# EasyEDA Pro project 密码存储器.eprj, board PCB1
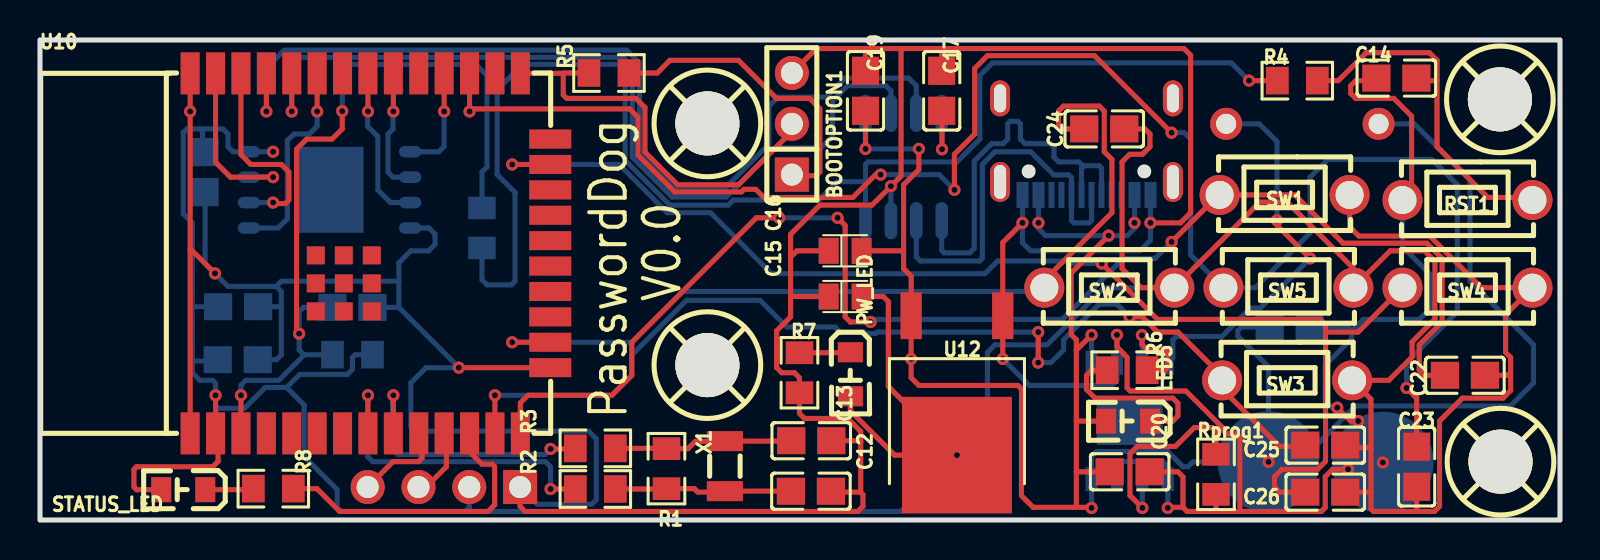
[diagram p2: board, top side]
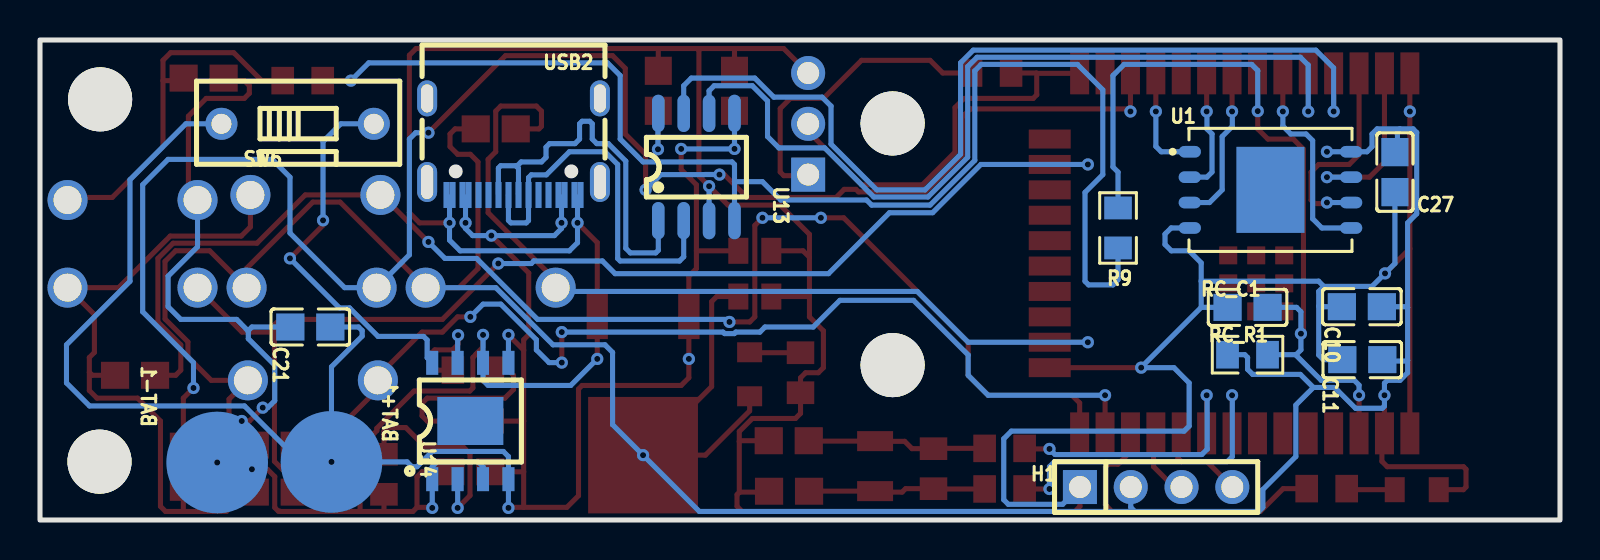
[diagram p3: board, bottom side, seen from below]

Outline 76 x 24 mm; copper layers: Top Layer, Bottom Layer. Coordinates in mm from the lower left corner of the outline.
Outline path: rectangle 0,24 76,0
Stack: Top Layer 0.035mm / Dielectric1 1.51mm FR4 er 4.5 / Bottom Layer 0.035mm

## Design rules (mm)
net UD+: DP1
net UD-: DP1
template: JLCPCB Capability(Two Layers Board)
spacing copperThickness1oz (default): track to track 0.102, other pairs 0.152 to 0.3
spacing copperThickness2oz: track to track 0.203, other pairs 0.152 to 0.3
track width copperThickness1oz (default): min 0.127, default 0.254, max 2.54
track width copperThickness2oz: min 0.203, default 0.254, max 2.54
differential pair differentialPair (default): width min 0.127, default 0.254, max 2.54; gap min 0.152, default 0.152
via viaSize (default): diameter min 0.5, default 0.61, max 10; hole min 0.3, default 0.305, max 6.3

## Placement (name value [footprint] x y rotation side)
BAT+1  -  [Test-Point-0.5mm]  61.43 2.91 0 top
BAT-1  -  [Test-Point-0.5mm]  67.14 2.87 0 top
BOOTOPTION1  PZ254V-11-03P  [HDR-TH_3P-P2.54-V-M]  37.59 19.81 90 top
C10  0.1uf  [C0805]  9.91 10.67 180 bottom
C11  22uf  [C0805]  9.89 8.02 180 bottom
C12  12pf  [C0805]  38.55 1.44 180 top
C13  12pf  [C0805]  38.56 3.96 180 top
C14  0.1uf  [C0805]  67.82 22.09 0 top
C15  10uF  [CAP-SMD_L2.1-W1.4-FD]  40.26 11.17 0 top
C16  22uF  [CAP-SMD_L2.1-W1.4-FD]  40.26 13.46 0 top
C17  0.1uf  [C0805]  45.08 21.46 90 top
C19  0.1uf  [C0805]  41.27 21.46 90 top
C20  10uf  [C0805]  54.48 2.41 0 top
C21  10uf  [C0805]  62.48 9.65 180 bottom
C22  0.1uf  [C0805]  71.25 7.24 0 top
C23  0.1uf  [C0805]  68.83 2.66 270 top
C24  0.1uf  [C0805]  53.21 19.56 0 top
C25  0.1uf  [C0805]  64.26 3.74 0 top
C26  0.1uf  [C0805]  64.26 1.39 0 top
C27  0.1uf  [C0805]  8.26 17.4 90 bottom
H1  -  [HDR-TH_4P-P2.54-V-M]  20.19 1.65 180 bottom
LED5  -  [LED_0805]  54.36 4.95 180 top
PW_LED  -  [LED_0805]  40.51 7.24 270 top
R1  7.5M  [R0805]  31.32 2.57 270 top
R2  0  [R0805]  27.77 1.55 180 top
R3  0  [R0805]  27.77 3.58 180 top
R4  0  [R0805]  62.86 21.97 180 top
R5  0  [R0805]  28.45 22.35 0 top
R6  10K  [R0805]  54.36 7.49 0 top
R7  10K  [R0805]  37.97 7.36 270 top
R8  10K  [R0805]  11.67 1.57 0 top
R9  0  [R0805]  22.1 14.6 90 bottom
RC_C1  1uf  [C0805]  15.62 10.63 180 bottom
RC_R1  10K  [R0805]  15.62 8.27 0 bottom
Rprog1  10K  [R0805]  58.8 2.28 90 top
RST1  ZX-QC36-4.3CJ  [KEY-TH_L6.0-W3.5-P6.50]  71.37 16 0 top
SCREW1  -  [M3螺丝]  73.02 2.92 0 top
SCREW2  -  [M3螺丝]  72.99 21.03 0 top
SCREW3  -  [M3螺丝]  33.37 7.74 0 top
SCREW4  -  [M3螺丝]  33.37 19.83 0 top
STATUS_LED  -  [LED_0805]  7.11 1.52 180 top
SW1  ZX-QC36-4.3CJ  [KEY-TH_L6.0-W3.5-P6.50]  62.23 16.25 0 top
SW2  ZX-QC36-4.3CJ  [KEY-TH_L6.0-W3.5-P6.50]  53.47 11.62 0 top
SW3  ZX-QC36-4.3CJ  [KEY-TH_L6.0-W3.5-P6.50]  62.36 6.98 0 top
SW4  ZX-QC36-4.3CJ  [KEY-TH_L6.0-W3.5-P6.50]  71.37 11.62 0 top
SW5  ZX-QC36-4.3CJ  [KEY-TH_L6.0-W3.5-P6.50]  62.42 11.62 0 top
SW6  Chager  [SW-TH_DSWB01LHGET]  63.12 19.81 90 bottom
U1  W25N01GVZEIG  [WSON-8_L8.0-W6.10-P1.27-TL-EP]  14.48 16.51 180 bottom
U10  ESP32-WROOM-32E-N8  [WIFI-SMD_ESP32-WROOM-32E]  16.51 13.33 0 top
U12  AMS1117CD-3.3  [TO-252-2_L6.5-W6.1-P4.58-LS10.0-BR]  45.85 6.73 90 top
U13  CH340N  [SOP-8_L4.9-W3.9-P1.27-LS6.0-BL]  43.18 17.65 180 bottom
U14  TP4056-42-ESOP8  [ESOP-8_L4.9-W3.9-P1.27-LS6.0-BL-EP]  54.48 4.95 180 bottom
USB2  KH-TYPE-C-16P  [USB-C-SMD_KH-TYPE-C-16P]  52.32 18.67 0 bottom
X1  32.768kHz  [FC-135R_L3.2-W1.5]  34.24 2.69 270 top

## Footprints (pads in the part's own frame, mm; a bottom-side part is the same pattern mirrored in y, then rotated)
C0805
  rect 1.41x1.35 smd: 1(-1,0) 2(1,0)
CAP-SMD_L2.1-W1.4-FD
  rect 1x1.3 smd: 1(-0.825,0) 2(0.825,0)
ESOP-8_L4.9-W3.9-P1.27-LS6.0-BL-EP
  rect 0.6x1.2 smd: 1(-1.905,-2.909) 2(-0.635,-2.909) 3(0.635,-2.909) 4(1.905,-2.909) 5(1.905,2.909) 6(0.635,2.909) 7(-0.635,2.909) 8(-1.905,2.909)
  rect 3.3x2.4 smd: 9(0,0)
FC-135R_L3.2-W1.5
  rect 1x1.8 smd: 1(-1.25,0) 2(1.25,0)
HDR-TH_3P-P2.54-V-M
  rect 1.7x1.7 hole 1.1: 1(-2.54,0)
  round 1.7 hole 1.1: 2(0,0) 3(2.54,0)
HDR-TH_4P-P2.54-V-M
  rect 1.7x1.7 hole 1.1: 1(-3.81,0)
  round 1.7 hole 1.1: 2(-1.27,0) 3(1.27,0) 4(3.81,0)
KEY-TH_L6.0-W3.5-P6.50
  round 2 hole 1.4: 1(-3.25,0) 2(3.25,0)
LED_0805
  rect 1x1.25 smd: 1(-1.15,0.005) 2(1.05,0.005)
M3螺丝
  round 3.2 hole 3.2: 1(0,0)
R0805
  rect 1.133x1.377 smd: 1(-1,0) 2(1,0)
SOP-8_L4.9-W3.9-P1.27-LS6.0-BL
  oval 0.63x1.865 smd: 1(-1.905,-2.683) 2(-0.635,-2.683) 3(0.635,-2.683) 4(1.905,-2.683) 5(1.905,2.683) 6(0.635,2.683) 7(-0.635,2.683) 8(-1.905,2.683)
SW-TH_DSWB01LHGET
  round 1.6 hole 1: 1(0,3.81) 2(0,-3.81)
Test-Point-0.5mm
  round 5.08 smd far side: 1(0,0)
TO-252-2_L6.5-W6.1-P4.58-LS10.0-BR
  rect 2.336x1.064 smd: 1(3.486,-2.29) 3(3.486,2.29)
  rect 5.826x5.491 smd: 4(-3.486,0)
USB-C-SMD_KH-TYPE-C-16P
  oval 1x2 hole 0.6x1.7: 1(-4.32,1.765) 2(4.32,1.765)
  oval 1x1.8 hole 0.6x1.4: 3(-4.32,-2.415) 4(4.32,-2.415)
  rect 0.3x1.3 smd: A1(-3.35,2.415) A4(-2.55,2.415) A5(-1.25,2.415) A6(-0.25,2.415) A7(0.25,2.415) A8(1.25,2.415) A9(2.55,2.415) A12(3.35,2.415) B1(3.05,2.415) B4(2.25,2.415) B5(1.75,2.415) B6(0.75,2.415) B7(-0.75,2.415) B8(-1.75,2.415) B9(-2.25,2.415) B12(-3.05,2.415)
WIFI-SMD_ESP32-WROOM-32E
  rect 0.95x2.1 smd: 1(-9.002,-9) 2(-7.732,-9) 3(-6.463,-9) 4(-5.192,-9) 5(-3.922,-9) 6(-2.652,-9) 7(-1.383,-9) 8(-0.113,-9) 9(1.157,-9) 10(2.428,-9) 11(3.697,-9) 12(4.968,-9) 13(6.237,-9) 14(7.508,-9) 25(7.508,9) 26(6.237,9) 27(4.968,9) 28(3.697,9) 29(2.428,9) 30(1.157,9) 31(-0.113,9) 32(-1.383,9) 33(-2.652,9) 34(-3.922,9) 35(-5.192,9) 36(-6.463,9) 37(-7.732,9) 38(-9.002,9)
  rect 2.1x0.95 smd: 15(9.002,-5.715) 16(9.002,-4.445) 17(9.002,-3.175) 18(9.002,-1.905) 19(9.002,-0.635) 20(9.002,0.635) 21(9.002,1.905) 22(9.002,3.175) 23(9.002,4.445) 24(9.002,5.715)
  rect 0.9x0.9 smd: 39(-2.721,-0.1) 39(-2.721,-1.5) 39(-2.721,-2.9) 39(-1.321,-0.1) 39(-1.321,-1.5) 39(-1.321,-2.9) 39(0.079,-0.1) 39(0.079,-1.5) 39(0.079,-2.9)
WSON-8_L8.0-W6.10-P1.27-TL-EP
  oval 1.115x0.581 smd: 1(-4.033,1.905) 2(-4.033,0.635) 3(-4.033,-0.635) 4(-4.033,-1.905) 5(4.033,-1.905) 6(4.033,-0.635) 7(4.033,0.635) 8(4.033,1.905)
  rect 3.4x4.3 smd: 9(0,0)

## Nets
As in the schematic.

Pads without a net: SCREW1 1; SCREW2 1; SCREW3 1; SCREW4 1; U1 9; U10 4 5 17 18 19 20 21 22 32 39; U14 9; USB2 1 2 3 4 A5 A8 B5 B8

## Via types
v1: diameter 0.61, hole 0.305, Top Layer to Bottom Layer, 62 vias

## Routing (per net, layer and track width the routed paths; a pad name or vN(x,y) marks a point on that pad's centre or on a via; arc(x,y) is an arc through that point)
GND: length 257.7
  Top Layer w0.254: 37.53,13.14 37.85,13.46 39.26,13.46 ; 37.53,13.14 37.53,11.15 ; 37.53,13.14 37.53,14.28 38.99,15.75 41.6,15.75 v1(42.55,16.69) 43.05,17.2 43.05,23.47 43.15,23.57 ; 7.51,13.57 v1(7.51,20.43) 7.51,22.2 7.63,22.33 ; 7.51,13.57 v1(8.75,12.33) ; 7.51,13.57 7.51,4.46 7.63,4.33 ; v1(64.86,5.62) 65.53,4.95 v1(65.91,4.95) ; 41.25,23.57 43.15,23.57 ; 41.25,23.57 38.82,23.57 BOOTOPTION1.3 ; 41.25,23.57 41.27,23.55 C19.2 ; 43.15,23.57 45.08,23.57 ; 37.53,11.15 37.53,10.16 36.83,9.46 36.83,7.62 37.08,7.36 37.72,7.36 37.97,7.11 R7.2 37.97,5.33 38.23,5.08 40.39,5.08 41.04,4.43 41.04,3.92 ; 37.53,11.15 37.55,11.17 39.26,11.17 ; 41.04,3.92 41.04,1.41 41.02,1.39 ; 41.04,3.92 40.99,3.96 C13.1 ; 58.8,0.43 Rprog1.1 ; 58.8,0.43 57.36,0.43 57.15,0.63 ; 58.8,0.43 59.94,0.43 ; v1(56.39,0.61) 56.42,0.63 57.15,0.63 ; 45.08,23.57 57.2,23.57 57.53,23.24 57.53,15.36 57.02,14.86 v1(55.53,14.86) ; 45.08,23.57 C17.2 ; C20.2 56.9,2.41 57.15,2.16 57.15,0.63 ; 66.82,21.97 65.79,21.97 65.53,21.71 65.53,21.33 65.79,21.08 67.69,21.08 68.58,20.19 68.58,16.45 RST1.1 ; H1.1 24,0.68 24.26,0.43 40.89,0.43 41.15,0.68 41.15,1.27 41.02,1.39 ; 59.94,0.43 64.01,0.43 64.02,0.44 64.08,0.44 64.26,0.62 64.26,2.17 64.63,2.54 v1(65.41,2.54) ; 59.94,0.43 60,0.48 60,4.14 59.82,4.31 59.31,4.31 59.16,4.47 59.16,4.59 57.3,6.45 54.51,6.45 54.36,6.6 54.36,8.12 54.2,8.28 54.2,8.29 53.85,8.65 v1(53.85,9.26) ; 41.02,1.39 39.59,1.39 C12.1 ; 25.64,7.62 v1(20.94,7.62) ; v1(48.14,8.05) U12.1 48.14,13.87 v1(49.12,14.86)
  Bottom Layer w0.254: v1(53.85,9.26) U14.6 53.85,6.98 53.59,6.73 49.46,6.73 v1(48.14,8.05) ; 17.94,11.94 12.07,11.94 11.81,11.68 ; 17.94,11.94 17.94,10.63 ; 17.94,11.94 17.94,12.86 18.54,13.46 19.43,13.46 19.75,13.78 19.75,14.3 19.44,14.6 U1.4 ; 17.94,10.63 20.95,7.62 19.3,7.62 18.54,6.86 18.54,4.7 18.8,4.44 27.43,4.44 27.81,4.06 27.81,1.01 27.58,0.78 24.87,0.78 H1.1 ; 17.94,10.63 RC_C1.1 ; 12.06,10.69 12.06,8.25 11.83,8.02 C11.1 ; 12.06,10.69 12.04,10.67 C10.1 ; 12.06,10.69 12.06,11.43 11.81,11.68 ; v1(42.55,16.69) U13.3 ; 11.81,11.68 9.4,11.68 v1(8.75,12.33) 8.26,12.82 C27.1 ; RST1.1 68.12,13.66 69.6,12.19 69.6,10.67 68.96,10.03 66.17,10.03 65.61,9.47 65.58,9.47 ; v1(56.39,0.61) U14.1 56.39,2.67 56.13,2.92 54.1,2.92 53.85,2.67 U14.3 ; v1(64.86,5.62) 64.61,5.62 64.26,5.97 64.26,7.74 65.58,9.07 65.58,9.47 ; 65.58,9.47 65.41,9.65 C21.1 ; USB2.A1 49.12,16.1 v1(49.12,14.86) 49.12,13.86 49.53,13.46 54.99,13.46 55.52,13.99 v1(55.52,14.86) 55.52,16.1 USB2.B1
  vias: v1(67.14,2.87)
VCC: length 116.6
  Top Layer w0.254: 51.82,8.49 v1(52.58,9.26) ; 51.82,8.49 51.82,4.94 ; 51.82,8.49 51.82,9.01 51.56,9.27 51.56,12.35 v1(53.43,14.22) ; 51.82,0.63 51.82,2.41 ; 51.82,0.63 49.66,0.63 49.07,1.21 49.07,6.55 48.89,6.73 43.94,6.73 43.56,7.11 v1(43.56,8.05) U12.3 43.56,10.22 43.56,12.19 43.18,12.57 43.18,13.46 ; 51.82,0.63 52.55,0.63 v1(52.58,0.61) ; 51.82,2.41 51.82,4.94 ; 51.82,2.41 C20.1 ; 43.18,13.46 43.18,16.76 43.94,17.52 v1(43.94,18.55) ; 43.18,13.46 41.26,13.46 ; v1(41.27,18.55) C19.1 ; LED5.2 51.82,4.94
  Bottom Layer w0.254: USB2.A4 49.92,16.1 v1(49.92,14.86) 49.92,14.58 50.28,14.22 v1(53.43,14.22) 54.37,14.22 54.74,14.59 54.74,14.84 v1(54.72,14.86) 54.72,16.1 USB2.B4 ; v1(43.94,18.55) v1(41.27,18.55) U13.5 ; v1(61.43,2.91) 62.98,2.91 65.78,5.7 73.52,5.7 74.68,6.86 74.68,8.76 71.5,11.94 71.5,17.02 68.71,19.81 SW6.1 ; v1(61.43,2.91) 61.43,7.66 59.89,9.19 59.89,9.47 60.07,9.65 C21.2 ; v1(61.43,2.91) 57.64,2.91 57.4,2.66 57.15,2.66 56.39,3.43 52.83,3.43 52.58,3.17 U14.4 v1(52.58,0.61) ; v1(52.58,9.26) U14.5
VDD33: length 198.7
  Top Layer w0.254: 68.83,0.43 69.72,0.43 69.98,0.68 69.98,4.95 71.12,6.09 73.15,6.09 73.53,6.47 73.53,7.39 ; 68.83,0.43 66.67,0.43 66.55,0.55 66.55,1.39 ; 68.83,0.43 68.83,1.53 68.77,1.6 C23.2 ; C24.2 55.25,19.56 55.5,19.3 55.5,18.67 55.12,18.28 54.48,18.28 54.1,17.9 54.1,12.57 55.05,11.62 SW2.2 61,15.9 62.36,15.9 65.67,12.58 SW5.2 67.51,13.46 69.22,13.46 69.75,12.93 69.75,10.05 68.61,8.91 68.61,8.15 67.44,6.98 SW3.2 66.55,6.04 66.55,3.55 ; 66.55,1.39 66.55,3.55 ; 66.55,1.39 C26.2 ; 66.55,3.55 66.48,3.62 65.39,3.62 C25.2 ; 73.53,7.39 73.53,8.12 73.28,8.38 73.28,10.27 SW4.2 72.07,11.62 69.49,14.2 65.94,14.2 65.48,14.65 SW1.2 ; 73.53,7.39 73.38,7.24 C22.2 ; 41.26,11.17 42.16,11.17 42.42,10.92 42.42,6.67 v1(45.85,3.24) 42.73,3.24 40.52,5.45 PW_LED.2 ; v1(8.78,6.24) 8.78,4.46 8.9,4.33 8.9,2.93 8.64,2.66 4.83,2.66 4.7,2.54 4.7,1.65 4.83,1.52 STATUS_LED.2
  Bottom Layer w0.254: C10.2 7.67,10.67 7.63,10.62 ; 8,19.56 7.34,19.56 7.16,19.38 7.16,15.31 7.62,14.86 7.62,10.64 7.63,10.62 ; 8,19.56 9.14,19.56 9.4,19.3 9.4,18.67 9.65,18.41 U1.8 v1(11.65,18.41) ; 8,19.56 8.13,19.43 8.13,18.52 C27.2 ; 7.63,10.62 7.62,10.62 7.62,7.99 ; 12.33,6.63 13.21,5.75 13.21,3.17 14.86,1.52 14.86,0.63 15.06,0.43 21.26,0.43 ; 12.33,6.63 12.98,7.28 15.37,7.28 15.62,7.53 15.62,8.12 15.76,8.27 RC_R1.2 ; 12.33,6.63 11.26,6.63 10.22,5.58 8.89,5.58 8.78,5.7 v1(8.78,6.24) 8.78,6.84 8.64,6.98 8,6.98 7.62,7.36 7.62,7.99 ; 21.26,0.43 43.03,0.43 v1(45.85,3.24) 47.37,4.77 47.37,8.38 47.75,8.76 50.35,8.76 53.21,11.62 SW2.2 ; 21.26,0.43 21.46,0.63 H1.2 ; 7.62,7.99 7.67,7.95 8.81,7.95 C11.2
ESP32_EN: length 107
  Top Layer w0.254: v1(12.95,9.32) 12.83,9.44 12.83,18.54 13.34,19.05 14.61,19.05 15.11,19.56 v1(15.11,20.44) ; v1(10.05,6.24) 10.05,4.46 10.17,4.33 ; R4.2 v1(60.45,21.97)
  Bottom Layer w0.254: v1(15.11,20.44) 15.11,22.48 15.42,22.78 21.79,22.78 22.35,22.22 22.35,17.65 22.1,17.4 R9.2 ; 13.22,8.26 11.94,6.98 10.29,6.98 10.05,6.74 v1(10.05,6.24) ; 13.22,8.26 13.22,8.27 RC_R1.1 ; 13.22,8.26 13.2,8.26 12.95,8.51 v1(12.95,9.32) 12.95,10.41 13.17,10.63 RC_C1.2 ; U13.4 41.27,16.92 ; 41.27,16.92 39.88,16.92 38.96,16 34.67,16 34.42,15.75 31.5,15.75 29.26,17.98 29.26,22.46 28.94,22.78 24.13,22.78 22.86,21.51 22.86,17.27 23.75,16.38 23.75,11.94 23.57,11.76 22.35,11.76 22.1,12.01 R9.1 ; 41.27,16.92 41.27,17.78 41.4,17.9 45.85,17.9 46.99,19.05 46.99,22.22 47.63,22.86 59.56,22.86 v1(60.45,21.97)
IIC_SCL: length 3.7
  Top Layer w0.254: H1.3 19.3,1.65 20.32,2.66 20.32,4.32 20.33,4.33 20.21,4.46
IIC_SDA: length 4.7
  Top Layer w0.254: H1.4 17.65,2.92 18.92,2.92 19.1,3.1 19.1,4.29 18.94,4.46
IO0: length 20.6
  Top Layer w0.254: U10.25 26.16,22.33 26.16,22.33 ; 26.16,22.33 26.16,21.26 26.34,21.08 29.79,21.08 30.25,20.62 30.25,18.39 31.88,16.76 34.92,16.76 37.59,19.43 BOOTOPTION1.2 ; 26.16,22.33 26.18,22.35 R5.1
IO0_USE: length 15.5
  Top Layer w0.254: R5.2 30.86,22.35 31.5,22.98 34.92,22.98 36.83,21.08 38.48,21.08 38.99,20.57 38.99,17.4 38.81,17.22 37.64,17.22 BOOTOPTION1.1
IO12: length 68.7
  Top Layer w0.254: v1(39.88,15.11) 40.26,14.73 40.26,10.16 40.51,9.9 v1(41.53,9.9) ; 24.14,4.33 24.02,4.46 24.02,5.85 24.4,6.24 28.59,6.24 29.59,7.24 29.59,8.89 35.81,15.11 v1(36.96,15.11) ; C22.1 69.22,7.24 68.96,7.49 68.96,8.76 70.1,9.9 70.1,13.08 69.34,13.84 65.15,13.84 62.74,16.25 SW1.1 58.93,16.25 v1(56.58,13.9)
  Bottom Layer w0.254: v1(41.53,9.9) 41.66,10.03 51.12,10.03 54.17,13.08 55.75,13.08 v1(56.58,13.9) ; v1(36.96,15.11) v1(39.88,15.11)
IO13: length 44.8
  Top Layer w0.254: 25.64,8.89 v1(23.61,8.89) ; SW2.1 50.22,11.99 53.59,15.36 53.59,18.03 53.21,18.41 53.21,20.44 52.96,20.7 51.18,20.7 50.93,20.44 50.93,19.68 51.05,19.56 C24.1
  Bottom Layer w0.254: SW2.1 50.03,11.43 32.13,11.43 29.59,8.89 v1(23.61,8.89)
IO14: length 52.1
  Top Layer w0.254: v1(49.91,9.39) v1(49.91,7.87) ; v1(54.48,10.16) 55.12,10.16 55.88,9.39 56.9,9.39 59.11,7.18 SW3.1 59.11,6.55 61.98,3.68 63.2,3.68 C25.1 ; 22.87,4.33 22.75,4.46 v1(22.75,6.24)
  Bottom Layer w0.254: v1(22.75,6.24) 28.59,6.24 29.59,7.24 29.59,8.25 32.32,10.98 36,10.98 37.34,9.65 39.75,9.65 40.01,9.39 41.21,9.39 41.29,9.32 41.77,9.32 41.85,9.39 v1(49.91,9.39) ; v1(49.91,7.87) 50.55,7.87 51.18,8.51 51.18,9.01 52.96,10.79 53.85,10.79 v1(54.48,10.16)
IO15: length 63.2
  Top Layer w0.254: 64.28,9.39 64.28,9.76 64.01,10.03 55.88,10.03 v1(53.09,12.82) ; 64.28,9.39 65.9,9.39 SW4.1 ; 64.28,9.39 64.28,2.93 63.88,2.54 62.1,2.54 61.72,2.16 61.72,1.65 61.98,1.39 C26.1 ; v1(23.61,17.78) 25.64,17.78
  Bottom Layer w0.254: v1(23.61,17.78) 28.96,17.78 31.37,15.36 33.53,15.36 36.58,12.32 47.24,12.32 47.88,12.95 51.31,12.95 51.44,12.82 v1(53.09,12.82)
IO16: length 88.4
  Top Layer w0.254: v1(45.72,16.51) 45.72,18.28 46.74,19.3 46.74,22.58 47.37,23.22 52.73,23.22 v1(56.58,19.36) ; v1(68.33,6.6) 68.83,6.09 C23.1 ; v1(42.03,17.27) 41.78,17.27 40.64,16.13 36.2,16.13 35.79,16.53 35.2,16.53 35.07,16.41 31.73,16.41 29.89,18.24 29.89,20.14 29.48,20.55 21.6,20.55 v1(21.48,20.43) 21.48,22.2 21.6,22.33
  Bottom Layer w0.254: v1(42.03,17.27) 42.3,17.27 42.3,17.28 42.79,17.28 42.79,17.27 44.96,17.27 v1(45.72,16.51) ; v1(56.58,19.36) 57.21,19.36 57.53,19.05 57.53,13.26 SW5.1 60.77,11.62 63.5,14.35 63.5,17.14 64.39,18.03 69.6,18.03 70.87,16.76 70.87,10.41 68.33,7.87 v1(68.33,6.6)
IO17: length 5.5
  Top Layer w0.254: 20.33,22.33 20.21,22.2 v1(20.21,20.43)
  Bottom Layer w0.254: U1.1 19.94,18.41 20.21,18.68 v1(20.21,20.43)
IO18: length 6.3
  Top Layer w0.254: v1(17.67,20.43) 17.67,22.2 17.79,22.33
  Bottom Layer w0.254: v1(17.67,20.43) 17.65,20.41 17.65,19.56 17.4,19.3 17.4,17.4 17.65,17.14 18.51,17.14
IO19: length 8
  Top Layer w0.254: v1(16.4,20.43) 16.4,22.2 16.52,22.33
  Bottom Layer w0.254: U1.3 17.53,15.87 16.89,16.51 16.89,19.17 16.38,19.68 16.38,20.41 v1(16.4,20.43)
IO21: length 10.5
  Top Layer w0.254: v1(13.86,20.43) 13.86,22.2 13.98,22.33
  Bottom Layer w0.254: U1.5 11.91,14.6 12.37,15.06 12.37,18.97 12.7,19.3 13.46,19.3 13.86,19.7 v1(13.86,20.43)
IO22: length 10.4
  Top Layer w0.254: v1(11.65,15.87) 11.71,15.82 12.27,15.82 12.45,16 12.45,17.4 12.06,17.78 10.54,17.78 10.05,18.27 10.05,22.2 10.17,22.33
  Bottom Layer w0.254: U1.6 v1(11.65,15.87)
IO23: length 8.9
  Top Layer w0.254: 8.9,22.33 8.78,22.2 8.78,17.89 9.53,17.14 v1(11.65,17.14)
  Bottom Layer w0.254: 10.45,17.14 v1(11.65,17.14)
IO27: length 15.2
  Top Layer w0.254: R8.2 13.84,1.57 14.98,0.43 22.4,0.43 22.73,0.76 22.73,2.66 22.61,2.79 22.1,2.79 21.6,3.28 21.6,4.33 21.48,4.46
IO32: length 16.7
  Top Layer w0.254: v1(16.4,6.24) 16.4,4.46 16.52,4.33 ; R2.2 v1(25.53,1.55)
  Bottom Layer w0.254: v1(25.53,1.55) 25.53,2.66 25.27,2.92 16.64,2.92 16.38,3.17 16.38,6.22 v1(16.4,6.24)
IO33: length 14
  Top Layer w0.254: v1(17.67,6.24) 17.67,4.46 17.79,4.33 ; v1(25.53,3.55) 26.74,3.55 R3.2
  Bottom Layer w0.254: v1(17.67,6.24) 17.64,6.21 17.64,3.54 17.91,3.27 25.25,3.27 v1(25.53,3.55)
RXD0: length 44.5
  Top Layer w0.254: 12.71,22.33 12.59,22.2 v1(12.59,20.43)
  Bottom Layer w0.254: v1(12.59,20.43) 12.59,22.74 12.98,23.14 29.15,23.14 29.62,22.67 29.62,18.14 31.6,16.15 34.31,16.15 36.76,18.61 39.05,18.61 39.62,19.17 39.62,20.95 40.39,21.71 42.29,21.71 42.55,21.46 U13.6
TP4056_CE: length 19.1
  Top Layer w0.254: 61.85,14.86 61.85,14.73 v1(63.5,13.08)
  Bottom Layer w0.254: v1(63.5,13.08) 61.02,10.6 60.52,10.6 59.1,9.18 56.82,9.18 56.64,9 56.64,8.11 U14.8 ; SW6.2 60.96,19.81 61.85,18.92 v1(61.85,14.98)
TXD0: length 47.5
  Top Layer w0.254: 11.44,22.33 11.32,22.2 v1(11.32,20.43)
  Bottom Layer w0.254: v1(11.32,20.43) 11.32,22.6 12.21,23.49 29.34,23.49 29.97,22.86 29.97,18.28 31.75,16.51 34.16,16.51 36.45,18.79 36.45,20.7 36.89,21.14 39.31,21.14 40.26,22.09 43.43,22.09 43.82,21.71 U13.7
UD+: length 19.7
  Bottom Layer w0.254: 52.15,17.66 52.15,17.69 51.94,17.9 50.93,17.9 50.7,18.13 50.7,18.64 50.52,18.82 49.25,18.82 49.02,19.05 49.02,19.81 48.89,19.94 48.51,19.94 48.39,19.81 48.39,19.05 48.16,18.82 47.58,18.82 46.71,17.95 46.71,13.59 46.48,13.36 45.21,13.36 45.08,13.48 U13.1 ; 52.15,17.66 52.08,17.59 52.08,16.32 52.08,16.32 ; 52.15,17.66 52.2,17.71 52.97,17.71 53.08,17.6 53.08,16.32
UD-: length 19.7
  Bottom Layer w0.254: U13.2 43.82,13.16 44.02,12.95 46.99,12.95 47.12,13.08 47.12,17.78 47.75,18.41 49.53,18.41 50.69,17.26 51.44,17.26 51.57,17.12 USB2.B7 51.57,14.97 51.69,14.86 52.45,14.86 52.58,14.98 52.58,16.25 USB2.A7
$1N2679: length 17.9
  Top Layer w0.254: R4.1 64.92,21.97 66.31,23.36 69.47,23.36 69.85,22.98 69.85,21.97 ; 69.85,21.97 69.85,18.67 72.39,16.13 74.62,16.13 ; 69.85,21.97 68.82,21.97
$1N3281: length 10.5
  Top Layer w0.254: Rprog1.2 58.8,4.44 58.62,4.62 57.71,4.62 56.77,3.68 54.86,3.68 54.5,3.31 54.5,1.22 v1(55.12,0.61)
  Bottom Layer w0.254: v1(55.12,0.61) U14.2
$1N3286: length 8.8
  Top Layer w0.254: R6.1 52.58,7.49 52.32,7.24 52.32,6.53 52.76,6.09 56.64,6.09 56.9,5.84 56.9,5.2 56.64,4.94 LED5.1
$1N3288: length 5.2
  Top Layer w0.254: R6.2 56.26,7.49 56.39,7.62 56.39,8.38 56.26,8.51 55.37,8.51 55.1,8.78 v1(55.1,9.24)
  Bottom Layer w0.254: v1(55.1,9.24) 55.12,9.22 U14.7
$1N3660: length 3.7
  Top Layer w0.254: v1(45.1,18.54) 45.1,20.44 C17.1
  Bottom Layer w0.254: v1(45.1,18.54) 45.1,20.32 U13.8
$1N3943: length 8.9
  Top Layer w0.254: C12.2 37.54,1.44 X1.2 34.19,1.39 32.89,1.39 32.72,1.57 R1.2 31.31,1.55 R2.1
$1N3944: length 9
  Top Layer w0.254: C13.2 37.54,3.94 34.24,3.94 34.23,3.93 32.77,3.93 32.4,3.57 R1.1 31.31,3.58 R3.1
$1N4641: length 2.6
  Top Layer w0.254: R7.1 40.5,8.36 40.52,8.39
$1N4668: length 2.4
  Top Layer w0.254: R8.1 10.61,1.52 8.26,1.52

## Text on the board
Top Silkscreen Layer: PasswordDog | V0.0
